# EAGLE design tc2ice (EAGLE 9.6.2)
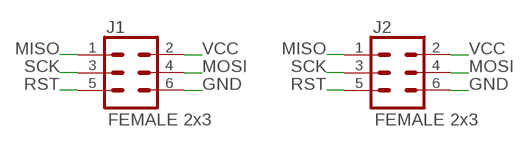
[diagram p0: schematic, sheet 1]

## Parts
J1  FEMALE 2x3  CONN_03X2FEMALE  [2X3]
J2  FEMALE 2x3  CONN_03X2FEMALE  [2X3]

## Nets
GND: J1.6 J2.6
MISO: J1.1 J2.1
MOSI: J1.4 J2.4
RST: J1.5 J2.5
SCK: J1.3 J2.3
VCC: J1.2 J2.2

## Library data of the parts
J1 J2 = SparkFun-Connectors:CONN_03X2: Multi connection point. Often used as Generic Header-pin footprint for 0.1 inch spaced/style header connections You can populate with any combo of single row headers, but if you'd like an exact match, check these: Header - 2x3 (Male, 0.1") <https://www.sparkfun.com/products/12807> (PRT-12807) Header - 2x3 (Female, 0.1") <https://www.sparkfun.com/products/13010> (PRT-13010) 2x3 Pin Shrouded Header <https://www.sparkfun.com/products/10877> (PRT-10877) On any of the 0.1 inch spaced packages, you can populate with these: Break Away Headers - Straight <https://www.sparkfun.com/products/116> (PRT-00116) Break Away Male Headers - Right Angle <https://www.sparkfun.com/products/553> (PRT-00553) Female Headers <https://www.sparkfun.com/products/115> (PRT-00115) Break Away Headers - Machine Pin <https://www.sparkfun.com/products/117> (PRT-00117) Break Away Female Headers - Swiss Machine Pin <https://www.sparkfun.com/products/743> (PRT-00743) Special note: the shrouded connector mates well with our 3x2 ribbon cables: Ribbon Crimp Connector - 6-pin (2x3, Female) <https://www.sparkfun.com/products/10651> (PRT-10651) Ribbon Cable - 6 wire (15ft) <https://www.sparkfun.com/products/10646> (PRT-10646); PROD_ID: CONN-11566

## Board
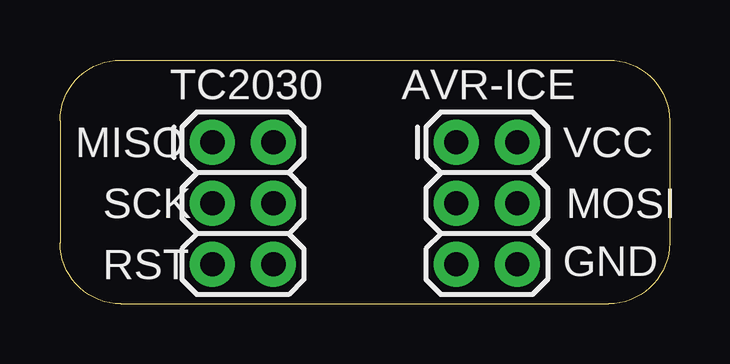
[diagram p1: board, top side]
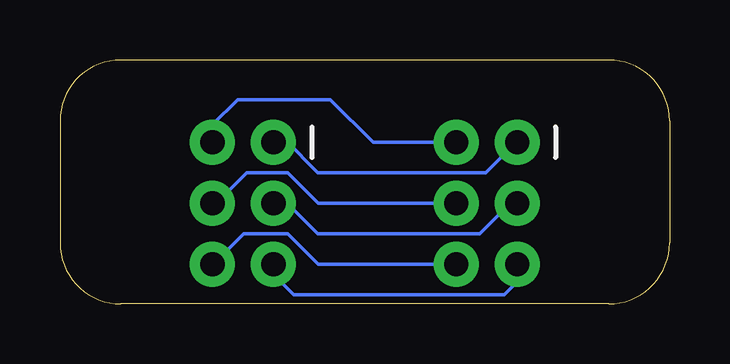
[diagram p2: board, bottom side, seen from below]

Size 25.4 x 10.16 mm. Coordinates in mm from the lower left corner, seen from the top.
Outline: 2.54,0 22.86,0 arc90 25.4,2.54 25.4,7.62 arc90 22.86,10.16 2.54,10.16 arc90 0,7.62 0,2.54 arc90 2.54,0
Copper layers (1*16): Top 0.035mm / dielectric 1.6mm / Bottom 0.035mm
Design rules "jlcpcb-2layers": minimum track width 5mil, minimum drill 0.3mm, track to track 5mil, track to pad 5mil, pad to pad 5mil, via to via 5mil, smd to smd 5mil, copper to edge 0.2mm, drill to drill 6mil, minimum pad ring 10mil, minimum via ring 3mil, stop-mask expansion 4mil, vias tented up to drill 0mil, thermal gap 10mil

### Footprints (pad centres in the part's own frame; a part is rotated, then mirrored left to right if it is on the bottom)
2X3 = drill 1.016 pad 1.88: 1 0,0; 2 0,2.54; 3 2.54,0; 4 2.54,2.54; 5 5.08,0; 6 5.08,2.54

### Placement (x,y rotation side)
J1  16.51,6.73 270 top
J2  6.35,6.73 270 top

### Tracks (layer width: path | path; a pad name or v marks a point on that pad's centre or on a via)
GND
  Bottom 0.152: J2.6 14.64,1.65 15.91,2.92 17.75,2.92 19.02,1.65 J1.6
MISO
  Bottom 0.152: J2.1 6.38,6.73 7.66,5.46 14.65,5.46 16,6.81 16.43,6.81 J1.1
MOSI
  Bottom 0.152: J2.4 14.64,4.19 15.91,5.46 17.62,5.46 18.89,4.19 J1.4
RST
  Bottom 0.152: J2.5 6.35,0.92 6.89,0.38 15.67,0.38 16.51,1.22 J1.5
SCK
  Bottom 0.152: J2.3 6.64,4.19 7.91,2.92 14.65,2.92 15.92,4.19 J1.3
VCC
  Bottom 0.152: J2.2 12.35,6.73 14.13,8.51 18,8.51 19.05,7.46 J1.2

### Text on the board
tPlace: TC2030 | AVR-ICE | MISO | VCC | SCK | MOSI | RST | GND